# EAGLE design untitled (EAGLE 7.6.0)
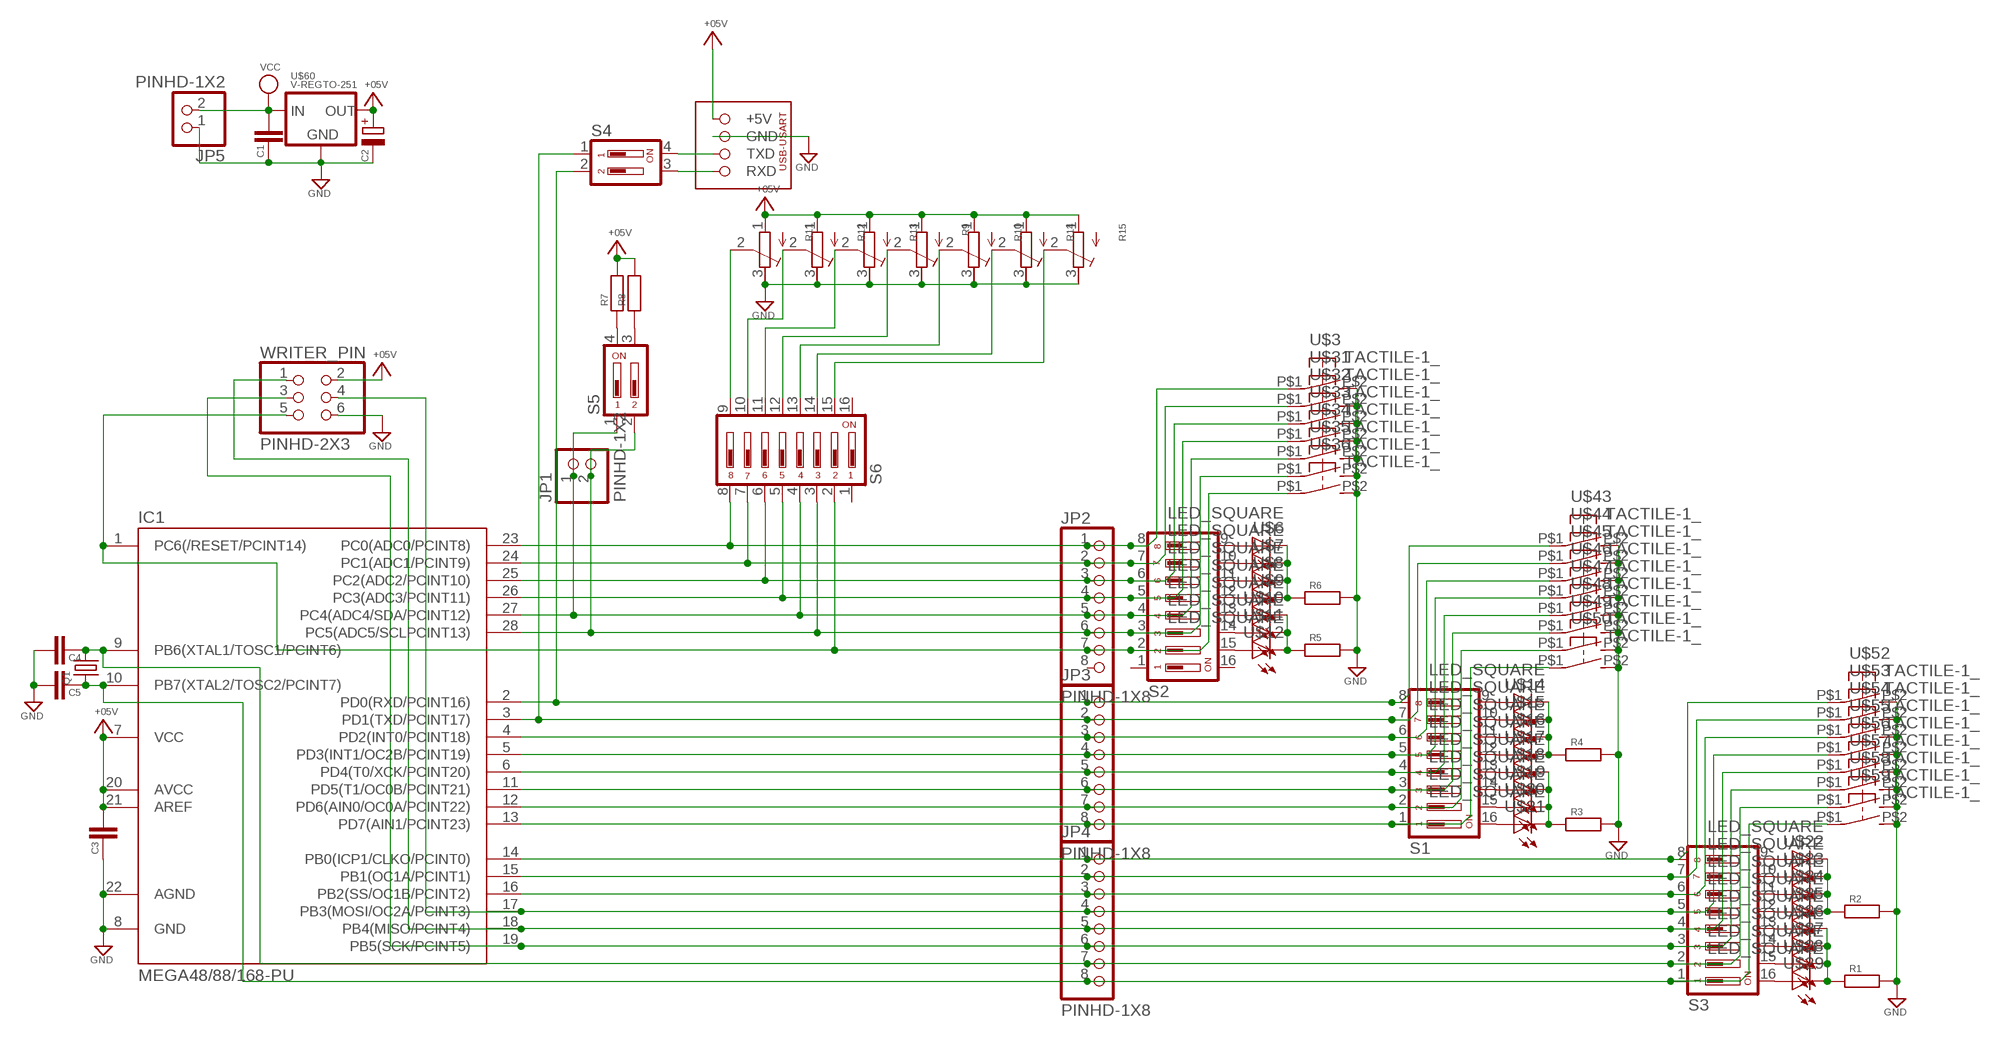
[diagram p0: schematic, sheet 1]

## Parts
C1  C-025-025X050  [C025-025X050]
C2  CPOL-E2.5-6  [E2,5-6]
C3  C-025-025X050  [C025-025X050]
C4  C-025-025X050  [C025-025X050]
C5  C-025-025X050  [C025-025X050]
IC1  MEGA48/88/168-PU  [DIL28-3]
JP1  PINHD-1X2  [1X02]
JP2  PINHD-1X8  [1X08]
JP3  PINHD-1X8  [1X08]
JP4  PINHD-1X8  [1X08]
JP5  PINHD-1X2  [1X02]
Q1  CRYSTALHC49S  [HC49/S]
R1  R-EU_1/4W(8MM)  [1/4W(8MM)]
R2  R-EU_1/4W(8MM)  [1/4W(8MM)]
R3  R-EU_1/4W(8MM)  [1/4W(8MM)]
R4  R-EU_1/4W(8MM)  [1/4W(8MM)]
R5  R-EU_1/4W(8MM)  [1/4W(8MM)]
R6  R-EU_1/4W(8MM)  [1/4W(8MM)]
R7  R-EU_1/4W(8MM)  [1/4W(8MM)]
R8  R-EU_1/4W(8MM)  [1/4W(8MM)]
R9  R-TRIMM_3339P  [3339P]
R10  R-TRIMM_3339P  [3339P]
R11  R-TRIMM_3339P  [3339P]
R12  R-TRIMM_3339P  [3339P]
R13  R-TRIMM_3339P  [3339P]
R14  R-TRIMM_3339P  [3339P]
R15  R-TRIMM_3339P  [3339P]
S1  DIP08YL  [DIP08YL]
S2  DIP08YL  [DIP08YL]
S3  DIP08YL  [DIP08YL]
S4  DIP02YL  [DIP02YL]
S5  DIP02YL  [DIP02YL]
S6  DIP08YL  [DIP08YL]
U$3  TACTILE-1_  [TACTILE_]
U$6  LED_SQUARE  [5020]
U$7  LED_SQUARE  [5020]
U$8  LED_SQUARE  [5020]
U$9  LED_SQUARE  [5020]
U$10  LED_SQUARE  [5020]
U$11  LED_SQUARE  [5020]
U$12  LED_SQUARE  [5020]
U$14  LED_SQUARE  [5020]
U$15  LED_SQUARE  [5020]
U$16  LED_SQUARE  [5020]
U$17  LED_SQUARE  [5020]
U$18  LED_SQUARE  [5020]
U$19  LED_SQUARE  [5020]
U$20  LED_SQUARE  [5020]
U$21  LED_SQUARE  [5020]
U$22  LED_SQUARE  [5020]
U$23  LED_SQUARE  [5020]
U$24  LED_SQUARE  [5020]
U$25  LED_SQUARE  [5020]
U$26  LED_SQUARE  [5020]
U$27  LED_SQUARE  [5020]
U$28  LED_SQUARE  [5020]
U$29  LED_SQUARE  [5020]
U$31  TACTILE-1_  [TACTILE_]
U$32  TACTILE-1_  [TACTILE_]
U$33  TACTILE-1_  [TACTILE_]
U$34  TACTILE-1_  [TACTILE_]
U$35  TACTILE-1_  [TACTILE_]
U$36  TACTILE-1_  [TACTILE_]
U$43  TACTILE-1_  [TACTILE_]
U$44  TACTILE-1_  [TACTILE_]
U$45  TACTILE-1_  [TACTILE_]
U$46  TACTILE-1_  [TACTILE_]
U$47  TACTILE-1_  [TACTILE_]
U$48  TACTILE-1_  [TACTILE_]
U$49  TACTILE-1_  [TACTILE_]
U$50  TACTILE-1_  [TACTILE_]
U$52  TACTILE-1_  [TACTILE_]
U$53  TACTILE-1_  [TACTILE_]
U$54  TACTILE-1_  [TACTILE_]
U$55  TACTILE-1_  [TACTILE_]
U$56  TACTILE-1_  [TACTILE_]
U$57  TACTILE-1_  [TACTILE_]
U$58  TACTILE-1_  [TACTILE_]
U$59  TACTILE-1_  [TACTILE_]
U$60  V-REGTO-251  [TO-251]
U$64  AE-FT234X  [AE-FT234X]
WRITER_PIN  PINHD-2X3  [2X03]

## Nets
+5V: C2.+ C3.1 IC1.7(VCC) IC1.20(AVCC) IC1.21(AREF) R7.2 R8.2 R9.1(E) R10.1(E) R11.1(E) R12.1(E) R13.1(E) R14.1(E) R15.1(E) U$60.3(OUT) U$64.P$1(+5V) WRITER_PIN.2 ; supply symbol labelled +05V
GND: C1.2 C2.- C3.2 C4.1 C5.1 IC1.8(GND) IC1.22(AGND) JP5.1 R1.2 R2.2 R3.2 R4.2 R5.2 R6.2 R9.3(A) R10.3(A) R11.3(A) R12.3(A) R13.3(A) R14.3(A) R15.3(A) U$3.P$2(S) U$31.P$2(S) U$32.P$2(S) U$33.P$2(S) U$34.P$2(S) U$35.P$2(S) U$36.P$2(S) U$43.P$2(S) U$44.P$2(S) U$45.P$2(S) U$46.P$2(S) U$47.P$2(S) U$48.P$2(S) U$49.P$2(S) U$50.P$2(S) U$52.P$2(S) U$53.P$2(S) U$54.P$2(S) U$55.P$2(S) U$56.P$2(S) U$57.P$2(S) U$58.P$2(S) U$59.P$2(S) U$60.2(GND) U$64.P$2(GND) WRITER_PIN.6
N$1: IC1.2(PD0(RXD/PCINT16)) JP3.1 S1.8 S4.2 U$43.P$1(P)
N$2: IC1.3(PD1(TXD/PCINT17)) JP3.2 S1.7 S4.1 U$44.P$1(P)
N$3: IC1.4(PD2(INT0/PCINT18)) JP3.3 S1.6 U$45.P$1(P)
N$4: IC1.5(PD3(INT1/OC2B/PCINT19)) JP3.4 S1.5 U$46.P$1(P)
N$5: IC1.6(PD4(T0/XCK/PCINT20)) JP3.5 S1.4 U$47.P$1(P)
N$6: IC1.11(PD5(T1/OC0B/PCINT21)) JP3.6 S1.3 U$48.P$1(P)
N$7: IC1.12(PD6(AIN0/OC0A/PCINT22)) JP3.7 S1.2 U$49.P$1(P)
N$8: IC1.13(PD7(AIN1/PCINT23)) JP3.8 S1.1 U$50.P$1(P)
N$9: IC1.28(PC5(ADC5/SCLPCINT13)) JP1.2 JP2.6 S2.3 S5.2 S6.3 U$35.P$1(P)
N$10: IC1.27(PC4(ADC4/SDA/PCINT12)) JP1.1 JP2.5 S2.4 S5.1 S6.4 U$34.P$1(P)
N$11: IC1.26(PC3(ADC3/PCINT11)) JP2.4 S2.5 S6.5 U$33.P$1(P)
N$12: IC1.25(PC2(ADC2/PCINT10)) JP2.3 S2.6 S6.6 U$32.P$1(P)
N$13: IC1.24(PC1(ADC1/PCINT9)) JP2.2 S2.7 S6.7 U$31.P$1(P)
N$14: IC1.23(PC0(ADC0/PCINT8)) JP2.1 S2.8 S6.8 U$3.P$1(P)
N$15: IC1.19(PB5(SCK/PCINT5)) JP4.6 S3.3 U$57.P$1(P) WRITER_PIN.3
N$16: IC1.18(PB4(MISO/PCINT4)) JP4.5 S3.4 U$56.P$1(P) WRITER_PIN.1
N$17: IC1.17(PB3(MOSI/OC2A/PCINT3)) JP4.4 S3.5 U$55.P$1(P) WRITER_PIN.4
N$18: IC1.16(PB2(SS/OC1B/PCINT2)) JP4.3 S3.6 U$54.P$1(P)
N$19: IC1.15(PB1(OC1A/PCINT1)) JP4.2 S3.7 U$53.P$1(P)
N$20: IC1.14(PB0(ICP1/CLKO/PCINT0)) JP4.1 S3.8 U$52.P$1(P)
N$21: IC1.1(PC6(/RESET/PCINT14)) JP2.7 S2.2 S6.2 U$36.P$1(P) WRITER_PIN.5
N$22: C4.2 IC1.9(PB6(XTAL1/TOSC1/PCINT6)) JP4.7 Q1.2 S3.2 U$58.P$1(P)
N$24: S2.9 U$6.P$1(A)
N$25: S2.10 U$7.P$1(A)
N$26: S2.11 U$8.P$1(A)
N$27: S2.12 U$9.P$1(A)
N$28: S2.13 U$10.P$1(A)
N$29: S2.14 U$11.P$1(A)
N$30: S2.15 U$12.P$1(A)
N$31: S4.4 U$64.P$3(TXD)
N$32: S1.9 U$14.P$1(A)
N$33: S1.10 U$15.P$1(A)
N$34: S1.11 U$16.P$1(A)
N$35: S1.12 U$17.P$1(A)
N$36: S1.13 U$18.P$1(A)
N$37: S1.14 U$19.P$1(A)
N$38: S1.15 U$20.P$1(A)
N$39: S1.16 U$21.P$1(A)
N$40: S3.9 U$22.P$1(A)
N$41: S3.10 U$23.P$1(A)
N$42: S3.11 U$24.P$1(A)
N$43: S3.12 U$25.P$1(A)
N$44: S3.13 U$26.P$1(A)
N$45: S3.14 U$27.P$1(A)
N$46: S3.15 U$28.P$1(A)
N$47: S3.16 U$29.P$1(A)
N$48: R1.1 U$26.P$2(C) U$27.P$2(C) U$28.P$2(C) U$29.P$2(C)
N$49: R2.1 U$22.P$2(C) U$23.P$2(C) U$24.P$2(C) U$25.P$2(C)
N$50: R3.1 U$18.P$2(C) U$19.P$2(C) U$20.P$2(C) U$21.P$2(C)
N$51: R4.1 U$14.P$2(C) U$15.P$2(C) U$16.P$2(C) U$17.P$2(C)
N$52: R5.1 U$10.P$2(C) U$11.P$2(C) U$12.P$2(C)
N$53: R6.1 U$6.P$2(C) U$7.P$2(C) U$8.P$2(C) U$9.P$2(C)
N$54: S4.3 U$64.P$4(RXD)
N$55: R7.1 S5.4
N$56: R8.1 S5.3
N$57: R11.2(S) S6.9
N$58: R12.2(S) S6.10
N$59: R13.2(S) S6.11
N$60: R9.2(S) S6.12
N$61: R10.2(S) S6.13
N$62: R14.2(S) S6.14
N$63: R15.2(S) S6.15
N$66: C5.2 IC1.10(PB7(XTAL2/TOSC2/PCINT7)) JP4.8 Q1.1 S3.1 U$59.P$1(P)
VCC: C1.1 JP5.2 U$60.1(IN)
Unconnected: JP2.8 S2.1 S2.16 S6.1 S6.16

## Library data of the parts
C1 C3-C5 = !Capasiter:C-: CAPACITOR, European symbol
C2 = !Capasiter:CPOL-: POLARIZED CAPACITOR, European symbol
IC1 = !avr:MEGA48/88/168-PU
JP1 JP5 = !pinhead(ﾋﾟﾝﾍｯﾀﾞ):PINHD-1X2: PIN HEADER
JP2-JP4 = !pinhead(ﾋﾟﾝﾍｯﾀﾞ):PINHD-1X8: PIN HEADER
Q1 = !crystal(水晶):CRYSTAL: CRYSTAL; OC_FARNELL: 1667008; OC_NEWARK: unknown
R1-R8 = !Resistor(抵抗):R-EU_: RESISTOR, European symbol
R9-R15 = !Resistor(抵抗):R-TRIMM_: Trimm resistor
S1-S3 S6 = switch-dil:DIP08YL: DIL/CODE SWITCH; OC_FARNELL: unknown; OC_NEWARK: unknown
S4 S5 = switch-dil:DIP02YL: DIL/CODE SWITCH; OC_FARNELL: unknown; OC_NEWARK: unknown
U$3 U$31-U$36 U$43-U$50 U$52-U$59 = !switch:TACTILE-1_
U$6-U$12 U$14-U$29 = !led:LED_SQUARE
U$60 = !FET_transister_v-reg:V-REG
U$64 = !usb-usart:AE-FT234X
WRITER_PIN = !pinhead(ﾋﾟﾝﾍｯﾀﾞ):PINHD-2X3: PIN HEADER

## Board
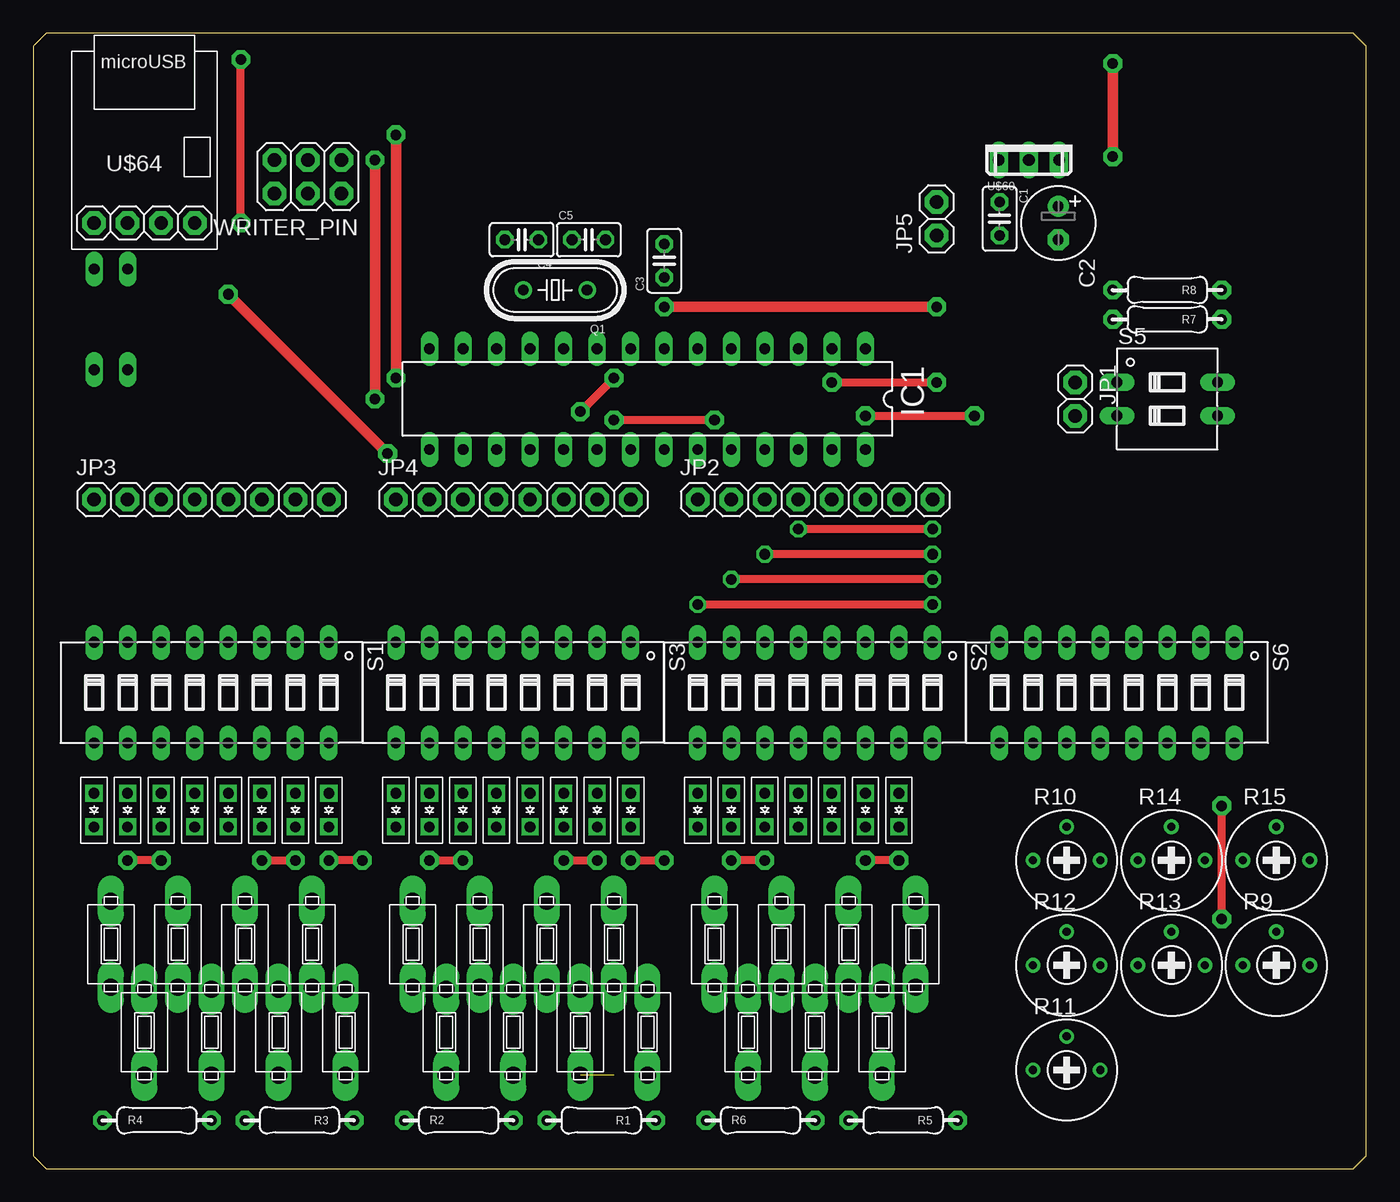
[diagram p1: board, top side]
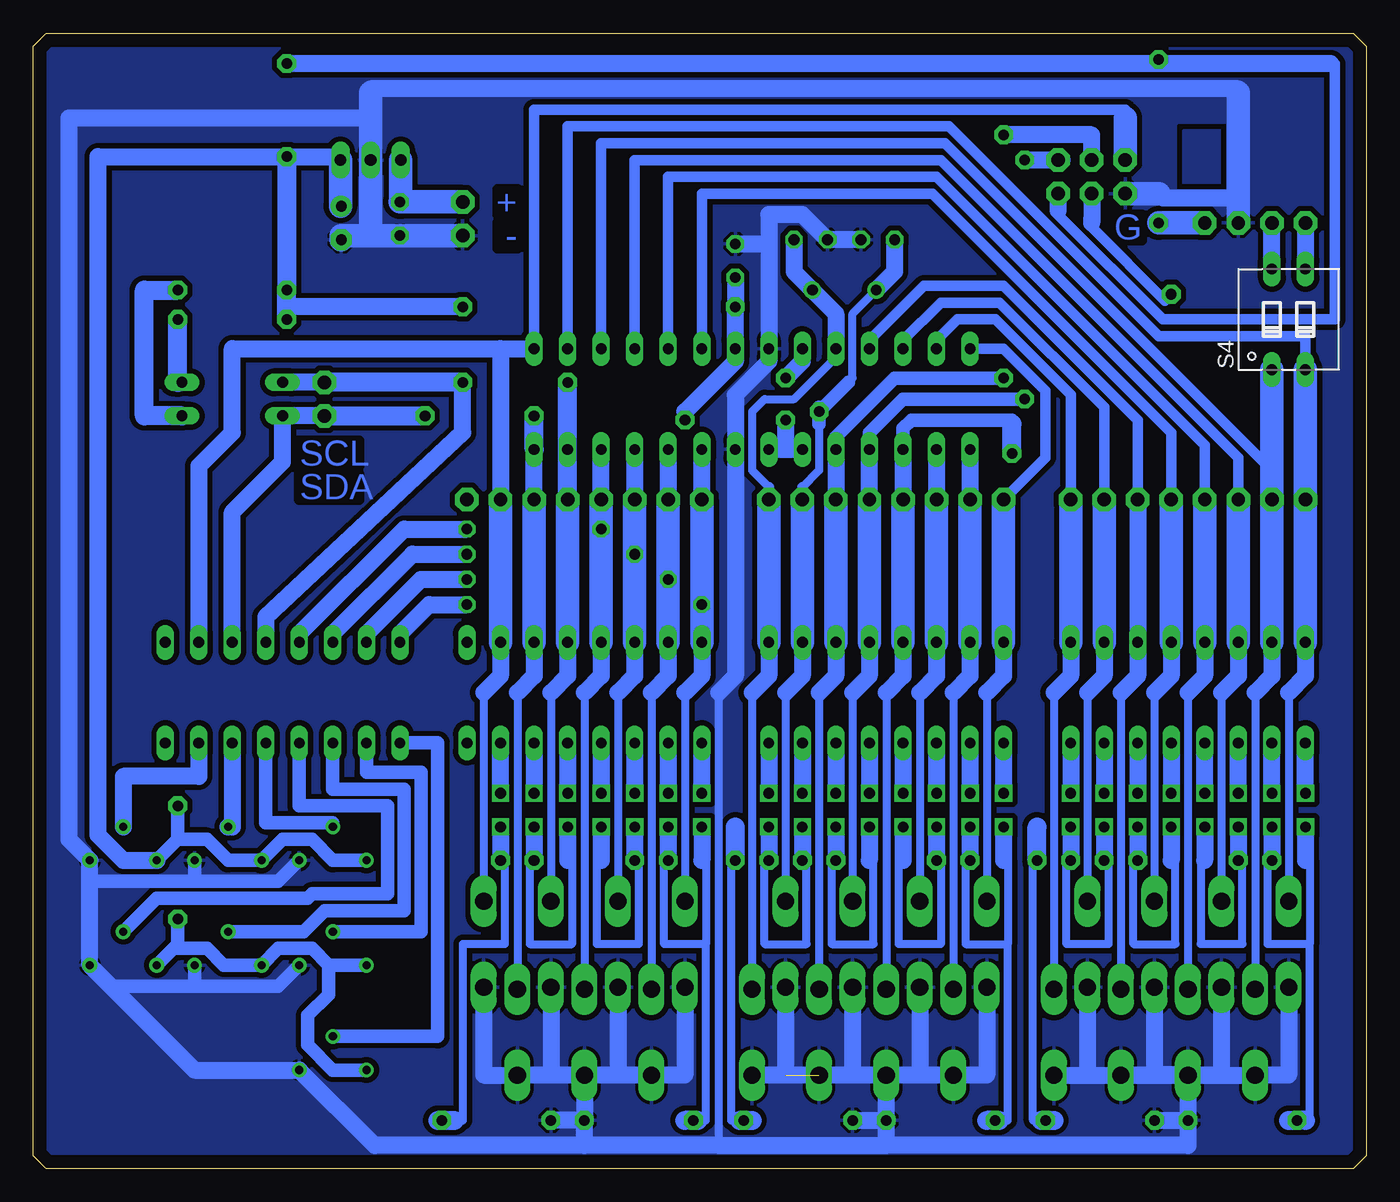
[diagram p2: board, bottom side, seen from below]

Size 101 x 86 mm. Coordinates in mm from the lower left corner, seen from the top.
Outline: 1,0 100,0 101,1 101,85 100,86 1,86 0,85 0,1 1,0
Copper layers (1*16): Top 0.035mm / dielectric 1.5mm / Bottom 0.035mm
Design rules "default *": minimum track width 10mil, minimum drill 24mil, track to track 0.2mm, track to pad 0.2mm, pad to pad 0.2mm, via to via 0.2mm, smd to smd 0.2mm, copper to edge 40mil, drill to drill 8mil, minimum pad ring 10mil, minimum via ring 8mil, stop-mask expansion 4mil, vias tented up to drill 0mil, thermal gap 10mil

### Footprints (pad centres in the part's own frame; a part is rotated, then mirrored left to right if it is on the bottom)
C025-025X050 = drill 0.813 octagon: 1 -1.27,0; 2 1.27,0
E2,5-6 = drill 0.813 pad 1.6: + -1.27,0 | drill 0.813 pad 1.6 octagon: - 1.27,0
DIL28-3 = drill 0.813 long: 1 -16.51,-3.81; 2 -13.97,-3.81; 3 -11.43,-3.81; 4 -8.89,-3.81; 5 -6.35,-3.81; 6 -3.81,-3.81; 7 -1.27,-3.81; 8 1.27,-3.81; 9 3.81,-3.81; 10 6.35,-3.81; 11 8.89,-3.81; 12 11.43,-3.81; 13 13.97,-3.81; 14 16.51,-3.81; 15 16.51,3.81; 16 13.97,3.81; 17 11.43,3.81; 18 8.89,3.81; 19 6.35,3.81; 20 3.81,3.81; 21 1.27,3.81; 22 -1.27,3.81; 23 -3.81,3.81; 24 -6.35,3.81; 25 -8.89,3.81; 26 -11.43,3.81; 27 -13.97,3.81; 28 -16.51,3.81
1X02 = drill 1.016 pad 1.778 octagon: 1 -1.27,0; 2 1.27,0
1X08 = drill 1.016 pad 1.778 octagon: 1 -8.89,0; 2 -6.35,0; 3 -3.81,0; 4 -1.27,0; 5 1.27,0; 6 3.81,0; 7 6.35,0; 8 8.89,0
HC49/S = drill 0.813: 1 -2.413,0; 2 2.413,0
1/4W(8MM) = drill 0.8 pad 1.422 octagon: 1 -4.128,0; 2 4.128,0
3339P = drill 0.61: 1 -2.54,0; 2 0,2.54; 3 2.54,0
DIP08YL = drill 0.813 long: 1 -8.89,-3.81; 2 -6.35,-3.81; 3 -3.81,-3.81; 4 -1.27,-3.81; 5 1.27,-3.81; 6 3.81,-3.81; 7 6.35,-3.81; 8 8.89,-3.81; 9 8.89,3.81; 10 6.35,3.81; 11 3.81,3.81; 12 1.27,3.81; 13 -1.27,3.81; 14 -3.81,3.81; 15 -6.35,3.81; 16 -8.89,3.81
DIP02YL = drill 0.813 long: 1 -1.27,-3.81; 2 1.27,-3.81; 3 1.27,3.81; 4 -1.27,3.81
TACTILE_ = drill 1.3 pad 1.676 long: P$1 3.25,0; P$2 -3.25,0
5020 = drill 0.8 pad 1.27 square: P$1 -1.27,0; P$2 1.27,0
TO-251 = drill 0.889 long: 1 -2.286,0; 2 0,0; 3 2.286,0
AE-FT234X = drill 1.016 pad 1.778 octagon: P$1 -3.81,0; P$2 -1.27,0; P$3 1.27,0; P$4 3.81,0
2X03 = drill 1.016 pad 1.778 octagon: 1 -2.54,-1.27; 2 -2.54,1.27; 3 0,-1.27; 4 0,1.27; 5 2.54,-1.27; 6 2.54,1.27

### Placement (x,y rotation side)
C1  73.21,71.94 270 top
C2  77.65,71.62 270 top
C3  47.81,68.76 90 top
C4  37.01,70.35 180 top
C5  42.09,70.35 0 top
IC1  46.54,58.28 180 top
JP1  78.92,58.28 270 top
JP2  59.24,50.66 0 top
JP3  13.52,50.66 0 top
JP4  36.38,50.66 0 top
JP5  68.44,71.94 90 top
Q1  39.55,66.54 180 top
R1  43.05,3.67 180 top
R2  32.25,3.67 0 top
R3  20.18,3.67 180 top
R4  9.39,3.67 0 top
R5  65.91,3.67 180 top
R6  55.11,3.67 0 top
R7  85.91,64.32 180 top
R8  85.91,66.54 180 top
R9  94.16,15.42 0 top
R10  78.29,23.36 0 top
R11  78.29,7.49 0 top
R12  78.29,15.42 0 top
R13  86.22,15.42 0 top
R14  86.22,23.36 0 top
R15  94.16,23.36 0 top
S1  13.52,36.06 180 top
S2  59.24,36.06 180 top
S3  36.38,36.06 180 top
S4  5.9,64.32 0 bottom
S5  85.91,58.28 270 top
S6  82.1,36.06 180 top
U$3  51.62,17.01 90 top
U$6  50.35,27.17 270 top
U$7  52.89,27.17 270 top
U$8  55.43,27.17 270 top
U$9  57.97,27.17 270 top
U$10  60.51,27.17 270 top
U$11  63.05,27.17 270 top
U$12  65.59,27.17 270 top
U$14  4.63,27.17 270 top
U$15  7.17,27.17 270 top
U$16  9.71,27.17 270 top
U$17  12.25,27.17 270 top
U$18  14.79,27.17 270 top
U$19  17.33,27.17 270 top
U$20  19.87,27.17 270 top
U$21  22.41,27.17 270 top
U$22  27.49,27.17 270 top
U$23  30.03,27.17 270 top
U$24  32.57,27.17 270 top
U$25  35.11,27.17 270 top
U$26  37.65,27.17 270 top
U$27  40.19,27.17 270 top
U$28  42.73,27.17 270 top
U$29  45.27,27.17 270 top
U$31  54.16,10.34 90 top
U$32  56.7,17.01 90 top
U$33  59.24,10.34 90 top
U$34  61.78,17.01 90 top
U$35  64.32,10.34 90 top
U$36  66.86,17.01 90 top
U$43  5.9,17.01 90 top
U$44  8.44,10.34 90 top
U$45  10.98,17.01 90 top
U$46  13.52,10.34 90 top
U$47  16.06,17.01 90 top
U$48  18.6,10.34 90 top
U$49  21.14,17.01 90 top
U$50  23.68,10.34 90 top
U$52  28.76,17.01 90 top
U$53  31.3,10.34 90 top
U$54  33.84,17.01 90 top
U$55  36.38,10.34 90 top
U$56  38.92,17.01 90 top
U$57  41.46,10.34 90 top
U$58  44,17.01 90 top
U$59  46.54,10.34 90 top
U$60  75.43,76.38 0 top
U$64  8.44,71.62 180 top
WRITER_PIN  20.82,75.11 180 top

### Tracks (layer width: path | path; a pad name or v marks a point on that pad's centre or on a via)
+5V  (via drill 0.8 pad 1.42)
  Top 0.61: v51.62,56.7 v44,56.7 | v90.03,18.91 v90.03,27.49 | v15.74,71.62 v15.74,84
  Top 0.813: v47.81,65.27 v68.44,65.27 | v81.78,83.69 v81.78,76.64
  Bottom 0.61: 23.36,72.57 23.36,72.25
  Bottom 0.813: 90.35,16.69 90.03,16.69 | 2.72,83.69 2.41,83.69 2.41,64.32 15.42,64.32 23.36,72.25
  Bottom 1.016: R10.1 78.29,23.36 79.88,24.95 82.1,24.95 R14.1 86.22,23.36 87.81,24.95 90.03,24.95 | R12.1 78.61,15.42 | 78.61,15.42 79.88,16.69 82.42,16.69 R13.1 86.54,15.42 87.81,16.69 90.03,16.69 v90.03,18.91 | 90.35,16.69 R9.1 | R11.1 78.29,7.49 80.19,9.39 80.19,11.61 78.61,13.2 78.61,15.42 | v90.03,27.49 90.03,24.95 | 90.03,24.95 R15.1
  Bottom 1.27: IC1.21 44,54.48 | 44,54.48 IC1.20 | v44,56.7 44,54.48 | C3.1 v47.81,65.27 IC1.7 47.81,61.14 51.62,57.33 v51.62,56.7 | R15.1 94.16,23.36 96.07,25.27 96.07,76.64 v81.78,76.64 77.72,76.64 U$60.3 | 77.65,72.83 C2.+ 77.72,72.89 | v68.44,65.27 81.78,65.27 | 2.72,83.69 15.74,83.69 | v15.74,84 15.74,83.69 | 15.74,83.69 v81.78,83.69 | WRITER_PIN.2 23.36,72.57
  Bottom 1.422: R7.2 R8.2 | v81.78,76.64 R8.2 | 81.78,65.27 R8.2
  Bottom 1.778: U$60.3 77.72,72.89 | U$64.P$1 v15.74,71.62
GND  (1 unrouted)
  Bottom 0.61: 49.08,36.06 49.08,1.77 | 75.43,81.78 75.43,80.83 | 15.74,73.84 15.42,73.53 | 9.71,81.46 9.71,81.78
  Bottom 1.016: R10.3 82.42,21.77 88.77,21.77 | 88.77,21.77 96.7,21.77 | R12.3 82.42,13.84 88.77,13.84 | R14.3 88.77,21.77 | R13.3 88.77,13.84 | 88.77,13.84 95.11,13.84
  Bottom 1.27: 21.14,7.09 U$50.P$2 U$46.P$2 | 21.14,7.09 U$48.P$2 16.06,7.09 | 16.06,7.09 U$46.P$2 | U$46.P$2 U$44.P$2 5.9,7.09 U$43.P$2 | U$45.P$2 10.98,7.09 U$46.P$2 | U$47.P$2 16.06,7.17 | U$49.P$2 21.14,7.09 | U$52.P$2 28.76,7.09 U$53.P$2 U$55.P$2 | U$55.P$2 38.92,7.09 | 38.92,7.09 44,7.09 | U$54.P$2 33.84,7.09 U$55.P$2 | U$56.P$2 38.92,7.09 | U$58.P$2 44,7.09 | 44,7.09 U$59.P$2 | U$3.P$2 51.62,7.09 U$31.P$2 U$33.P$2 | U$32.P$2 56.7,7.09 U$33.P$2 | U$33.P$2 U$35.P$2 | U$34.P$2 61.78,7.09 U$35.P$2 | U$36.P$2 66.86,7.09 U$35.P$2 | R1.2 R2.2 | U$33.P$2 R6.2 | R6.2 R5.2 | R2.2 U$55.P$2 | R3.2 R4.2 | 16.06,7.09 16.06,7.17 | 16.06,7.17 13.52,7.17 R4.2 | 59.24,1.77 49.08,1.77 36.38,1.77 | 59.24,1.77 R6.2 | 36.38,1.77 R2.2 | U$46.P$2 R4.2 | R4.2 13.52,1.77 36.38,1.77 | C3.2 45.27,70.03 | 45.27,70.03 IC1.8 45.27,61.14 47.81,58.6 IC1.22 47.81,37.33 49.08,36.06 | 59.24,1.77 75.11,1.77 R11.3 88.77,7.49 95.11,13.84 R9.3 96.7,21.77 R15.3 98.29,24.95 98.29,79.56 75.43,79.56 | 9.71,81.78 75.43,81.78 | C4.1 C5.1 42.73,72.25 45.27,72.25 45.27,70.03 | 15.42,73.53 9.71,73.53
  Bottom 1.778: 75.43,70.67 U$60.2 75.43,79.56 75.43,80.83 75.43,81.46 | 75.43,70.67 C1.2 JP5.1 | 75.43,70.67 77.65,70.67 C2.- | U$64.P$2 9.71,73.53 9.71,81.46 | WRITER_PIN.6 15.74,73.84
  pour Bottom (isolate 0.406, rank 2): -1.72,-1.41 -1.72,87.81 102.73,87.81 102.73,-1.41
N$1
  Bottom 0.61: 5.9,36.06 U$43.P$1
  Bottom 0.813: 60.51,62.73 IC1.2 60.51,78.92 31.61,78.92 15.74,63.05 4.63,63.05 S4.2
  Bottom 1.27: S1.8 4.63,37.33 5.9,36.06
  Bottom 1.778: S1.8 JP3.1 S4.2
N$2
  Bottom 0.61: 8.44,36.06 U$44.P$1
  Bottom 0.813: 57.97,63.37 IC1.3 57.97,77.65 31.93,77.65 7.17,52.89
  Bottom 1.27: S1.7 7.17,37.33 8.44,36.06
  Bottom 1.778: S1.7 JP3.2 7.17,52.89 S4.1
N$3
  Bottom 0.61: 10.98,36.06 U$45.P$1
  Bottom 0.813: JP3.3 9.71,53.84 32.25,76.38 55.43,76.38 IC1.4
  Bottom 1.27: S1.6 9.71,37.33 10.98,36.06
  Bottom 1.778: JP3.3 S1.6
N$4
  Bottom 0.61: 13.52,36.06 U$46.P$1
  Bottom 0.813: JP3.4 12.25,54.79 32.57,75.11 52.89,75.11 IC1.5
  Bottom 1.27: S1.5 12.25,37.33 13.52,36.06
  Bottom 1.778: JP3.4 S1.5
N$5
  Bottom 0.61: 16.06,36.06 U$47.P$1
  Bottom 0.813: JP3.5 14.79,55.74 32.88,73.84 50.35,73.84 IC1.6
  Bottom 1.27: S1.4 14.79,37.33 16.06,36.06
  Bottom 1.778: JP3.5 S1.4
N$6
  Bottom 0.61: 18.6,36.06 U$48.P$1
  Bottom 0.813: JP3.6 17.33,56.7 27.49,66.86 33.52,66.86 37.65,62.73 IC1.11
  Bottom 1.27: JP3.6 S1.3 17.33,37.33 18.6,36.06
N$7
  Bottom 0.61: 21.14,36.06 U$49.P$1
  Bottom 0.813: JP3.7 19.87,57.65 27.8,65.59 32.25,65.59 35.11,62.73 IC1.12
  Bottom 1.27: S1.2 19.87,37.33 21.14,36.06
  Bottom 1.778: JP3.7 S1.2
N$8
  Bottom 0.61: 23.68,36.06 U$50.P$1
  Bottom 0.813: IC1.13 32.57,62.73 30.98,64.32 28.12,64.32 22.41,58.6 22.41,57.65 JP3.8
  Bottom 1.27: S1.1 22.41,37.33 23.68,36.06
  Bottom 1.778: JP3.8 S1.1
N$9  (via drill 0.8 pad 1.42)
  Top 0.61: v63.05,57.02 v71.3,57.02
  Bottom 0.61: 64.32,36.06 U$35.P$1
  Bottom 1.27: JP1.2 S5.2 82.1,53.52 85.91,49.71 S6.3 | JP2.6 IC1.28 | S2.3 63.05,37.33 64.32,36.06
  Bottom 1.422: IC1.28 v63.05,57.02 | JP1.2 v71.3,57.02
  Bottom 1.778: JP2.6 S2.3
N$10  (via drill 0.8 pad 1.42)
  Top 0.61: v60.51,59.55 v68.44,59.55
  Bottom 0.61: 61.78,36.06 U$34.P$1
  Bottom 1.27: IC1.27 JP2.5 | JP1.1 S5.1 | 83.37,40.51 S6.4 83.37,41.77 68.44,55.74 v68.44,59.55 | S2.4 60.51,37.33 61.78,36.06
  Bottom 1.422: JP2.5 v60.51,59.55 | v68.44,59.55 JP1.1
  Bottom 1.778: JP2.5 S2.4
N$11  (via drill 0.8 pad 1.27)
  Top 0.61: v68.13,48.44 v57.97,48.44
  Bottom 0.61: 59.24,36.06 U$33.P$1
  Bottom 1.27: JP2.4 IC1.26 | S6.5 80.83,40.51 72.89,48.44 v68.13,48.44 | S2.5 57.97,37.33 59.24,36.06
  Bottom 1.778: S2.5 v57.97,48.44 JP2.4
N$12  (via drill 0.8 pad 1.27)
  Top 0.61: v68.13,46.54 v55.43,46.54
  Bottom 0.61: 56.7,36.06 U$32.P$1
  Bottom 1.27: IC1.25 JP2.3 | S6.6 78.29,40.51 72.25,46.54 v68.13,46.54 | S2.6 55.43,37.33 56.7,36.06
  Bottom 1.778: JP2.3 v55.43,46.54 S2.6
N$13  (via drill 0.8 pad 1.27)
  Top 0.61: v68.13,44.63 v52.89,44.63
  Bottom 0.61: 54.16,36.06 U$31.P$1
  Bottom 1.27: IC1.24 JP2.2 | S6.7 75.75,40.51 71.62,44.63 v68.13,44.63 | S2.7 52.89,37.33 54.16,36.06
  Bottom 1.778: JP2.2 v52.89,44.63 S2.7
N$14  (via drill 0.8 pad 1.27)
  Top 0.61: v68.13,42.73 v50.35,42.73
  Bottom 0.61: 51.62,36.06 U$3.P$1
  Bottom 1.27: JP2.1 IC1.23 | S6.8 73.21,40.51 70.98,42.73 v68.13,42.73 | S2.8 50.35,37.33 51.62,36.06
  Bottom 1.778: JP2.1 v50.35,42.73 S2.8
N$15  (via drill 0.8 pad 1.42)
  Top 0.813: v27.49,59.87 v27.49,78.29
  Bottom 0.61: 41.46,36.06 U$57.P$1
  Bottom 0.813: IC1.19 40.19,55.43
  Bottom 1.016: v27.49,59.87 35.74,59.87 40.19,55.43
  Bottom 1.27: IC1.19 JP4.6 | v27.49,78.29 20.82,78.29 WRITER_PIN.3 | S3.3 40.19,37.33 41.46,36.06
  Bottom 1.778: JP4.6 S3.3
N$16  (via drill 0.8 pad 1.42)
  Top 0.813: v25.9,76.38 v25.9,58.28
  Bottom 0.61: 38.92,36.06 U$56.P$1
  Bottom 1.016: IC1.18 37.65,55.74 35.11,58.28 v25.9,58.28
  Bottom 1.27: JP4.5 IC1.18 | 23.04,76.38 WRITER_PIN.1 v25.9,76.38 | S3.4 37.65,37.33 38.92,36.06
  Bottom 1.778: S3.4 JP4.5
N$17  (via drill 0.8 pad 1.42)
  Top 0.813: v26.85,54.16 v14.79,66.22
  Bottom 0.61: 36.38,36.06 U$55.P$1 | 20.82,71.3 20.82,71.94 | 26.85,56.7 26.85,56.38
  Bottom 0.813: 20.82,71.3 15.26,65.75 v14.79,66.22
  Bottom 1.016: IC1.17 35.11,56.06 34.47,56.7 26.85,56.7
  Bottom 1.27: IC1.17 JP4.4 | S3.5 35.11,37.33 36.38,36.06 | WRITER_PIN.4 20.82,71.94 20.82,71.62
  Bottom 1.422: v26.85,54.16 26.85,56.38
  Bottom 1.778: JP4.4 S3.5
N$18
  Bottom 0.61: 33.84,36.06 U$54.P$1
  Bottom 1.27: IC1.16 JP4.3 | S3.6 32.57,37.33 33.84,36.06
  Bottom 1.778: JP4.3 S3.6
N$19
  Bottom 0.61: 31.3,36.06 U$53.P$1
  Bottom 1.27: IC1.15 JP4.2 | S3.7 30.03,37.33 31.3,36.06
  Bottom 1.778: S3.7 JP4.2
N$20
  Bottom 0.61: 28.76,36.06 U$52.P$1
  Bottom 0.813: IC1.14 27.49,62.09 24.31,58.92 24.31,53.84 JP4.1
  Bottom 1.27: S3.8 27.49,37.33 28.76,36.06
  Bottom 1.778: JP4.1 S3.8
N$21
  Bottom 0.61: 66.86,36.06 U$36.P$1 | 18.28,80.19 18.28,79.56
  Bottom 0.813: 63.05,62.41 IC1.1 63.05,80.19 18.28,80.19
  Bottom 1.27: 65.59,62.09 JP2.7 | 88.45,40.51 S6.2 88.45,53.2 85.91,55.74 85.91,62.09 65.59,62.09 | 65.59,62.09 IC1.1 | S2.2 65.59,37.33 66.86,36.06
  Bottom 1.778: S2.2 JP2.7 | WRITER_PIN.5 18.28,79.56
N$22  (via drill 0.8 pad 1.42)
  Top 0.61: v41.46,57.33 v44,59.87
  Bottom 0.61: 44,36.06 U$58.P$1 | 42.73,51.62 41.46,52.89 41.46,56.38 | v41.46,57.33 41.46,57.65 | 42.73,61.46 IC1.9 | Q1.2 38.92,64.76 38.92,59.87 39.87,58.92
  Bottom 0.813: JP4.7 42.73,51.62
  Bottom 1.016: v41.46,57.33 39.87,58.92 39.23,59.55 | 41.46,57.65 41.46,56.38
  Bottom 1.27: C4.2 35.74,67.94 Q1.2 | S3.2 42.73,37.33 44,36.06 | v44,59.87 42.73,61.14 IC1.9
  Bottom 1.778: S3.2 JP4.7
N$24
  Bottom 1.27: U$6.P$1 S2.9
N$25
  Bottom 1.27: S2.10 U$7.P$1
N$26
  Bottom 1.27: S2.11 U$8.P$1
N$27
  Bottom 1.27: S2.12 U$9.P$1
N$28
  Bottom 1.27: S2.13 U$10.P$1
N$29
  Bottom 1.27: S2.14 U$11.P$1
N$30
  Bottom 1.27: U$12.P$1 S2.15
N$31
  Bottom 1.27: S4.4 U$64.P$3
N$32
  Bottom 1.27: U$14.P$1 S1.9
N$33
  Bottom 1.27: U$15.P$1 S1.10
N$34
  Bottom 1.27: U$16.P$1 S1.11
N$35
  Bottom 1.27: U$17.P$1 S1.12
N$36
  Bottom 1.27: S1.13 U$18.P$1
N$37
  Bottom 1.27: S1.14 U$19.P$1
N$38
  Bottom 1.27: S1.15 U$20.P$1
N$39
  Bottom 1.27: S1.16 U$21.P$1
N$40
  Bottom 1.27: S3.9 U$22.P$1
N$41
  Bottom 1.27: S3.10 U$23.P$1
N$42
  Bottom 1.27: S3.11 U$24.P$1
N$43
  Bottom 1.27: S3.12 U$25.P$1
N$44
  Bottom 1.27: S3.13 U$26.P$1
N$45
  Bottom 1.27: S3.14 U$27.P$1
N$46
  Bottom 1.27: S3.15 U$28.P$1
N$47
  Bottom 1.27: S3.16 U$29.P$1
N$48  (via drill 0.8 pad 1.42)
  Top 0.61: v40.19,23.36 v42.73,23.36 | v45.27,23.36 v47.81,23.36
  Bottom 0.61: v42.73,23.36 42.41,23.36 42.41,17.01 45.59,17.01 45.59,23.36 v45.27,23.36 | v40.19,23.36 40.51,23.36 40.51,17.01 37.33,17.01 37.33,23.36 37.65,23.36 | v47.81,23.36 48.12,23.36 48.12,3.67 R1.1
  Bottom 1.27: U$29.P$2 v45.27,23.36 | U$28.P$2 v42.73,23.36 | U$27.P$2 v40.19,23.36 | U$26.P$2 37.65,23.36
  Bottom 1.422: 47.49,3.67 R1.1 46.54,3.67 | v47.81,23.36 47.81,25.9
N$49  (via drill 0.8 pad 1.42)
  Top 0.61: v30.03,23.36 v32.57,23.36
  Bottom 0.61: 27.17,17.01 30.34,17.01 30.34,23.36 v30.03,23.36 | v32.57,23.36 32.25,23.36 32.25,17.01 35.42,17.01 35.42,23.36 35.11,23.36 | 27.49,23.36 27.17,23.36 27.17,17.01 | 27.17,17.01 27.17,3.67 R2.1
  Bottom 1.27: U$25.P$2 35.11,23.36 | U$24.P$2 v32.57,23.36 | U$23.P$2 v30.03,23.36 | U$22.P$2 27.49,23.36
  Bottom 1.422: 28.76,3.67 R2.1 27.8,3.67
N$50  (via drill 0.8 pad 1.42)
  Top 0.61: v17.33,23.36 v19.87,23.36 | v24.95,23.36 v22.41,23.36
  Bottom 0.61: 14.79,23.36 14.47,23.36 14.47,17.01 17.64,17.01 17.64,23.36 v17.33,23.36 | v19.87,23.36 19.55,23.36 19.55,17.01 22.73,17.01 22.73,23.36 v22.41,23.36 | v24.95,23.36 25.27,23.36 25.27,3.67 R3.1
  Bottom 1.27: U$21.P$2 v22.41,23.36 | U$20.P$2 v19.87,23.36 | U$19.P$2 v17.33,23.36 | U$18.P$2 14.79,23.36
  Bottom 1.422: v24.95,23.36 24.95,25.9 | 23.68,3.67 R3.1 24.63,3.67
N$51  (via drill 0.8 pad 1.42)
  Top 0.61: v9.71,23.36 v7.17,23.36
  Bottom 0.61: 4.31,17.01 7.49,17.01 7.49,23.36 v7.17,23.36 | 4.63,23.36 4.31,23.36 4.31,17.01 | v9.71,23.36 9.39,23.36 9.39,17.01 12.56,17.01 12.56,23.36 12.25,23.36 | 4.63,3.67 4.31,3.67 4.31,17.01
  Bottom 1.27: U$17.P$2 12.25,23.36 | U$16.P$2 v9.71,23.36 | U$15.P$2 v7.17,23.36 | U$14.P$2 4.63,23.36
  Bottom 1.422: 4.63,3.67 R4.1 5.9,3.67
N$52  (via drill 0.8 pad 1.42)
  Top 0.61: v65.59,23.36 v63.05,23.36
  Bottom 0.61: v63.05,23.36 63.37,23.36 63.37,17.01 60.19,17.01 60.19,23.36 60.51,23.36 | v65.59,23.36 65.27,23.36 65.27,17.01 68.44,17.01 68.44,3.67 69.08,3.67 70.35,3.67
  Bottom 1.27: U$12.P$2 v65.59,23.36 | U$11.P$2 v63.05,23.36 | U$10.P$2 60.51,23.36
  Bottom 1.422: 69.08,3.67 R5.1 70.35,3.67
N$53  (via drill 0.8 pad 1.42)
  Top 0.61: v55.43,23.36 v52.89,23.36
  Bottom 0.61: 50.03,17.01 53.2,17.01 53.2,23.36 v52.89,23.36 | 57.97,23.36 58.28,23.36 58.28,17.01 55.11,17.01 55.11,23.36 v55.43,23.36 | 50.35,23.36 50.03,23.36 50.03,17.01 | 50.03,17.01 50.03,3.67 R6.1
  Bottom 1.27: U$9.P$2 57.97,23.36 | U$8.P$2 v55.43,23.36 | U$7.P$2 v52.89,23.36 | U$6.P$2 50.35,23.36
  Bottom 1.422: 51.62,3.67 R6.1 50.66,3.67
N$54
  Bottom 1.27: U$64.P$4 S4.3
N$55
  Bottom 1.27: S5.4 90.03,59.55
  Bottom 1.422: 90.03,59.55 R7.1
N$56
  Bottom 1.422: S5.3 92.58,57.02 92.58,66.54 R8.1
N$57
  Bottom 1.016: S6.9 70.35,32.25 70.35,10.03 R11.2
N$58
  Bottom 1.016: S6.10 75.75,30.03 71.62,30.03 71.62,17.96 R12.2
N$59
  Bottom 1.016: S6.11 78.29,28.76 72.89,28.76 72.89,19.55 78.92,19.55 80.51,17.96 R13.2
N$60
  Bottom 1.016: S6.12 80.83,27.49 74.16,27.49 74.16,20.82 79.88,20.82 80.19,20.5 91.62,20.5 R9.2
N$61
  Bottom 1.016: S6.13 83.37,26.22 78.29,26.22 R10.2
N$62
  Bottom 1.27: S6.14 85.91,25.9 R14.2
N$63
  Bottom 1.27: S6.15 88.45,29.71 94.16,29.71 R15.2
N$64
  pour Bottom (isolate 0.406): 10.98,78.61 13.84,78.61 13.84,74.48 10.98,74.48
N$66
  Bottom 0.61: 46.54,36.06 U$59.P$1 | 45.27,51.62 46.54,52.89 46.54,57.33 45.59,58.28 43.36,58.28 40.19,61.46 IC1.10
  Bottom 0.813: 45.27,51.62 JP4.8
  Bottom 1.27: IC1.10 40.19,64.76 Q1.1 43.36,67.94 C5.2 | S3.1 45.27,37.33 46.54,36.06
  Bottom 1.778: JP4.8 S3.1
VCC
  Bottom 1.27: 73.14,73.21 C1.1
  Bottom 1.778: JP5.2 C1.1 | U$60.1 73.14,73.21

### Text on the board
Bottom: + | G | - | SCL | SDA